# Altium schematic sheet OpAmps.SchDoc
size A3
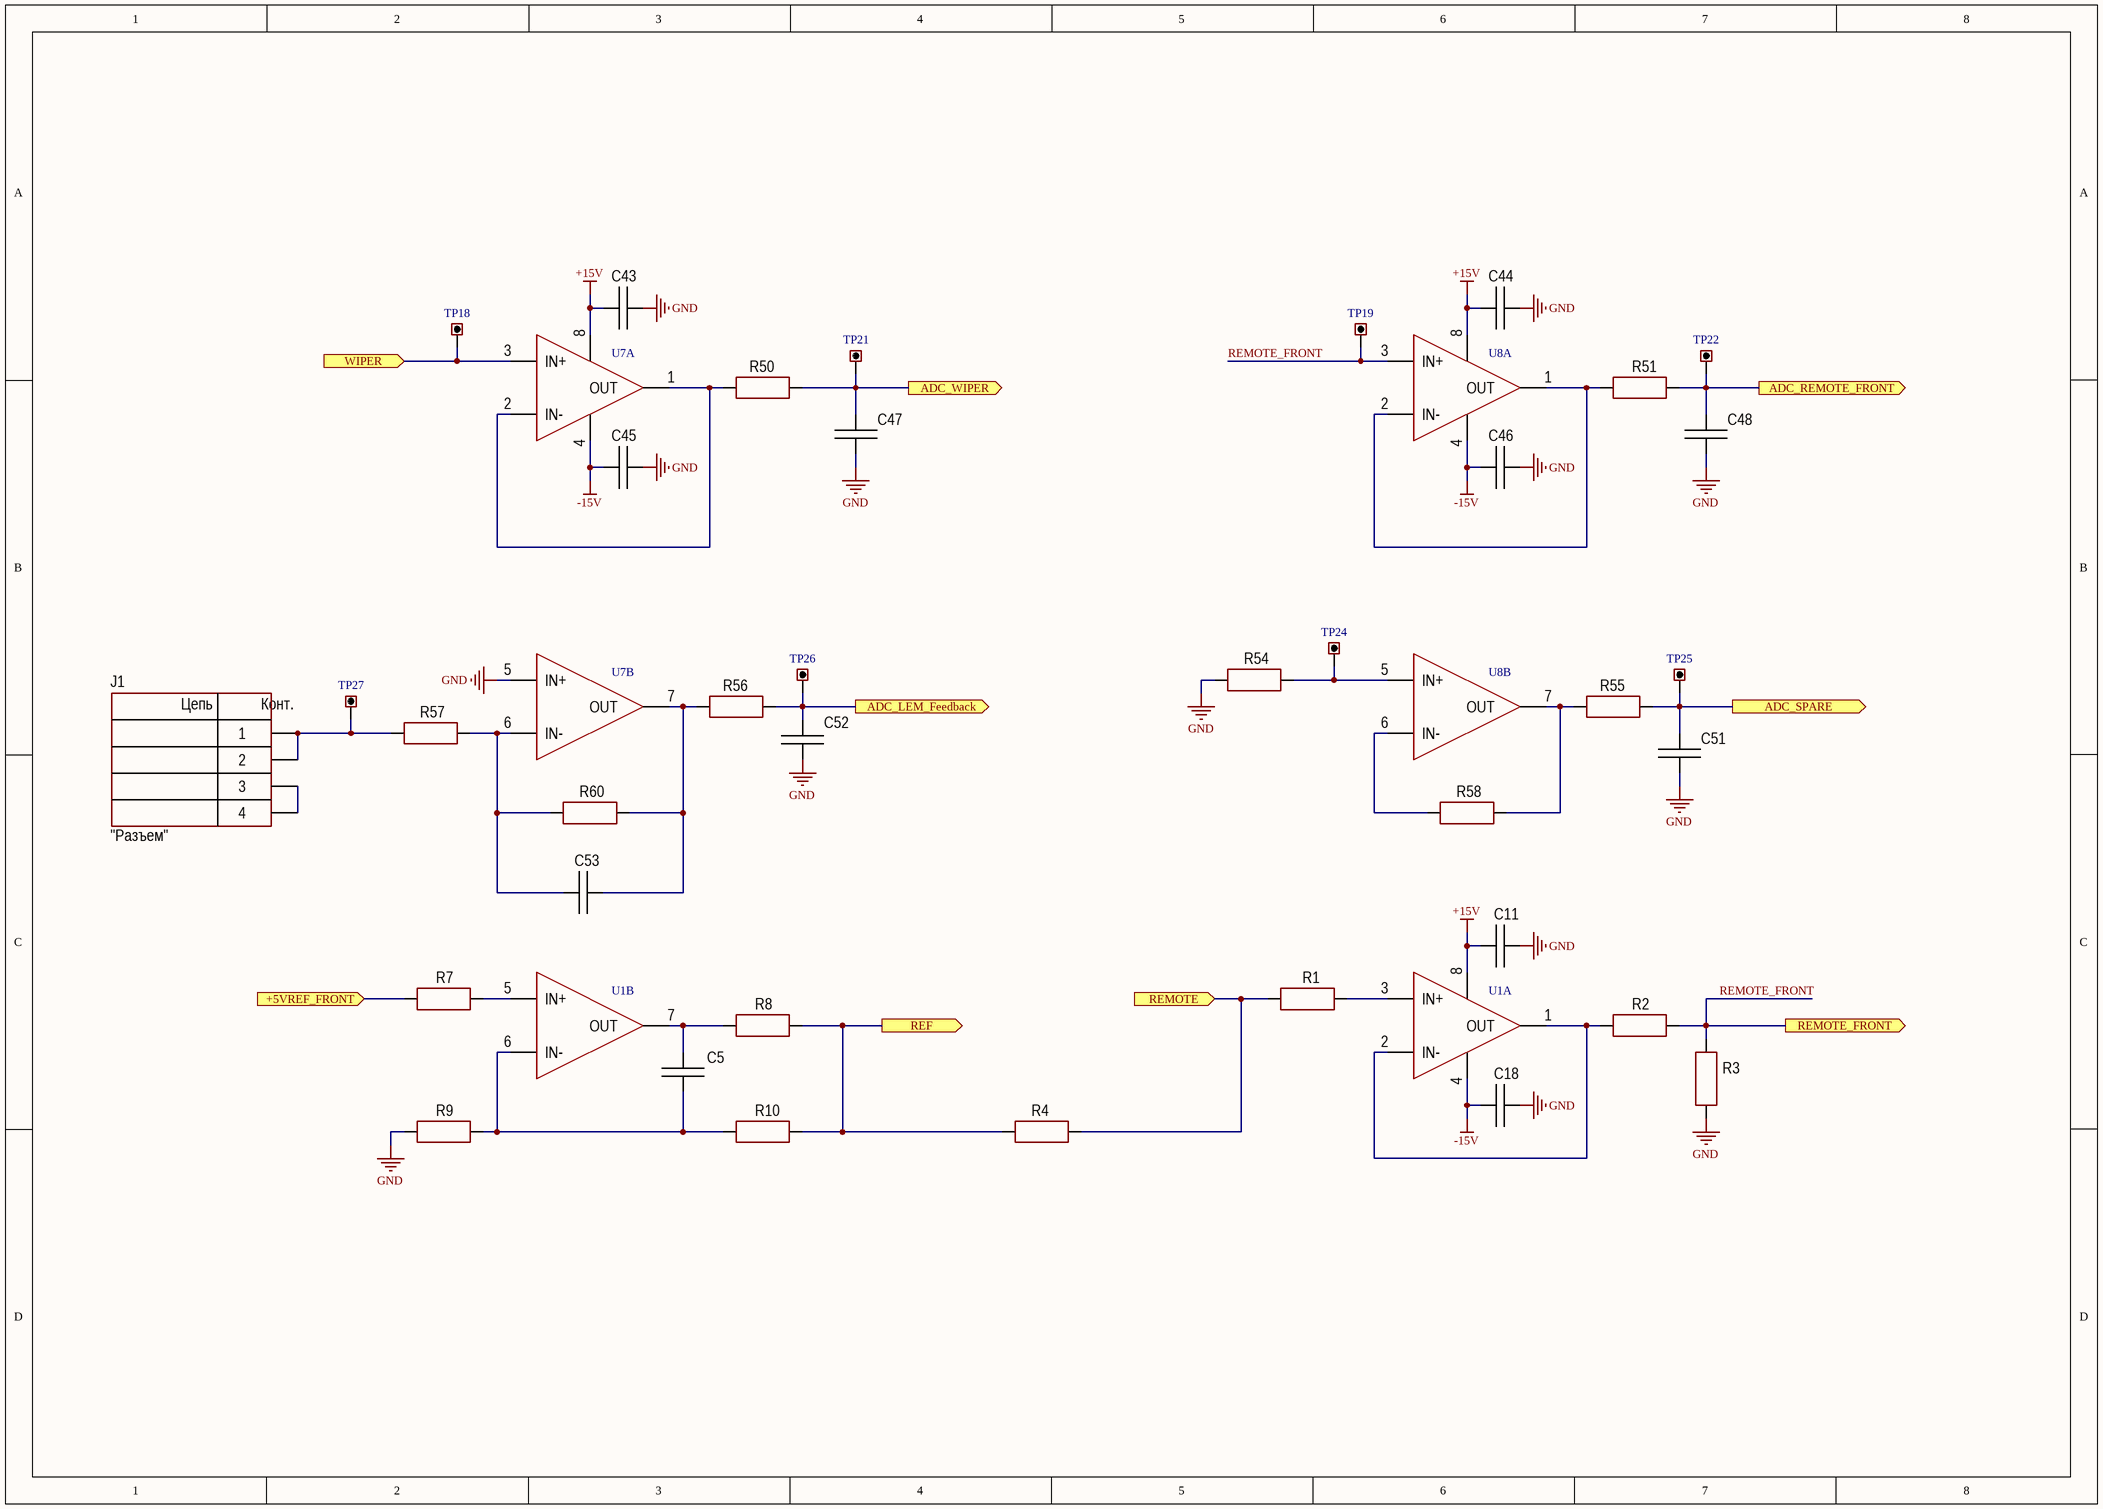
[diagram p0: OpAmps.SchDoc]

## Parts
C5  (no value)  [CAP: 1206]
C11  (no value)  [CAP: 1206]
C18  (no value)  [CAP: 1206]
C43  (no value)  [CAP: 1206]
C44  (no value)  [CAP: 1206]
C45  (no value)  [CAP: 1206]
C46  (no value)  [CAP: 1206]
C47  (no value)  [CAP: 1206]
C48  (no value)  [CAP: 1206]
C51  (no value)  [CAP: 1206]
C52  (no value)  [CAP: 1206]
C53  (no value)  [CAP: 1206]
J1  CommentText: "Разъем"  [39-29-9043]
R1  (no value)  [RES: 1206]
R2  (no value)  [RES: 1206]
R3  (no value)  [RES: 1206]
R4  (no value)  [RES: 1206]
R7  (no value)  [RES: 1206]
R8  (no value)  [RES: 1206]
R9  (no value)  [RES: 1206]
R10  (no value)  [RES: 1206]
R50  (no value)  [RES: 1206]
R51  (no value)  [RES: 1206]
R54  (no value)  [RES: 1206]
R55  (no value)  [RES: 1206]
R56  (no value)  [RES: 1206]
R57  (no value)  [RES: 1206]
R58  (no value)  [RES: 1206]
R60  (no value)  [RES: 1206]
TP18  Test_Point  [Test_Point]  (value not drawn)  (no BOM)
TP19  Test_Point  [Test_Point]  (value not drawn)  (no BOM)
TP21  Test_Point  [Test_Point]  (value not drawn)  (no BOM)
TP22  Test_Point  [Test_Point]  (value not drawn)  (no BOM)
TP24  Test_Point  [Test_Point]  (value not drawn)  (no BOM)
TP25  Test_Point  [Test_Point]  (value not drawn)  (no BOM)
TP26  Test_Point  [Test_Point]  (value not drawn)  (no BOM)
TP27  Test_Point  [Test_Point]  (value not drawn)  (no BOM)
U1  (no value)  [8-SOIC]  (parts A,B of 2)
U7  (no value)  [8-SOIC]  (parts A,B of 2)
U8  (no value)  [8-SOIC]  (parts A,B of 2)

## Ports
+5VREF_FRONT (in), ADC_LEM_Feedback (out), ADC_REMOTE_FRONT (out), ADC_SPARE (out), ADC_WIPER (out), REF (out), REMOTE (in), REMOTE_FRONT (out), WIPER (in)

## Nets
+15V: C11.2 C43.2 C44.2 U1.8(V+) U7.8(V+) U8.8(V+)
-15V: C18.1 C45.2 C46.2 U1.4(V-) U7.4(V-) U8.4(V-)
GND: C11.1 C18.2 C43.1 C44.1 C45.1 C46.1 C47.1 C48.1 C51.1 C52.1 R3.1 R9.1 R54.1 U7.5(IN+)
+5VREF_FRONT: R7.1 ; port +5VREF_FRONT
ADC_LEM_Feedback: C52.2 R56.2 TP26.1 ; port ADC_LEM_Feedback
ADC_REMOTE_FRONT: C48.2 R51.2 TP22.1 ; port ADC_REMOTE_FRONT
ADC_SPARE: C51.2 R55.2 TP25.1 ; port ADC_SPARE
ADC_WIPER: C47.2 R50.2 TP21.1 ; port ADC_WIPER
REF: R4.1 R8.2 R10.2 ; port REF
REMOTE: R1.1 R4.2 ; port REMOTE
REMOTE_FRONT: R2.2 R3.2 TP19.1 U8.3(IN+) ; port REMOTE_FRONT
WIPER: TP18.1 U7.3(IN+) ; port WIPER
NetC5_1: C5.1 R9.2 R10.1 U1.6(IN-)
NetC5_2: C5.2 R8.1 U1.7(OUT)
NetC53_1: C53.1 R56.1 R60.2 U7.7(OUT)
NetC53_2: C53.2 R57.2 R60.1 U7.6(IN-)
NetJ1_1: J1.1 J1.2 R57.1 TP27.1
NetJ1_3: J1.3 J1.4
NetR1_2: R1.2 U1.3(IN+)
NetR2_1: R2.1 U1.1(OUT) U1.2(IN-)
NetR7_2: R7.2 U1.5(IN+)
NetR50_1: R50.1 U7.1(OUT) U7.2(IN-)
NetR51_1: R51.1 U8.1(OUT) U8.2(IN-)
NetR54_2: R54.2 TP24.1 U8.5(IN+)
NetR55_1: R55.1 R58.2 U8.7(OUT)
NetR58_1: R58.1 U8.6(IN-)

## Notes on the sheet
- (in symbol PBD-4) Цепь; Конт.

## Library data of the parts
C5 C11 C18 C43-C46 C53 = Ceramic_1206: Manufacturer: Yageo; PartNumber: CC1206KRX7R9BB104; ValueManufacturerPartNumber: Ceramic capacitor, 0.1μF, 1206; TypeCapacitor: Ceramic capacitor; Tolerance: ±10%; TypeDielectric: X7R; Voltage: 50V; Value: 0.1μF; Package: 1206; HelpURL: https://www.digikey.com/product-detail/en/yageo/CC1206KRX7R9BB104/311-1179-1-ND/303089; Temperature: -55...+125°C
C47 C48 C51 C52 = Ceramic_1206: Manufacturer: Yageo; PartNumber: CC1206KRX7R9BB104; ValueManufacturerPartNumber: Ceramic capacitor, 33pF, 1206; TypeCapacitor: Ceramic capacitor; Tolerance: ±10%; TypeDielectric: X7R; Voltage: 50V; Value: 33pF; Package: 1206; HelpURL: https://www.digikey.com/product-detail/en/yageo/CC1206KRX7R9BB104/311-1179-1-ND/303089; Temperature: -55...+125°C
J1 = PBD-4: Manufacturer: MOLEX; ValueManufacturerPartNumber: Connector, MOLEX, 39-29-9043, 4pin; TypeConnector: Connector; VoltageMax: 500VAC; Pitch: 2.54mm; CurrentMax: 3A; Multichannel: 4pin; HelpURL: https://www.chipdip.ru/product/pbd-4; PartNumber: 39-29-9043
R1 R7 R9 R10 R54 R58 R60 = Resistor_1206: Manufacturer: Yageo; PartNumber: RC1206JR-07100RL; ValueManufacturerPartNumber: Resistor, 10K, 1206; Power: 0.25W; Tolerance: ±5%; Value: 10K; Package: 1206; HelpURL: https://www.digikey.com/product-detail/en/yageo/RC1206JR-07100RL/311-100ERCT-ND/732153; Temperature: -55...+125°C; TypeResistor: Resistor
R2 R3 = Resistor_1206: Manufacturer: Yageo; PartNumber: RC1206JR-07100RL; ValueManufacturerPartNumber: Resistor, 2K, 1206; Power: 0.25W; Tolerance: ±5%; Value: 2K; Package: 1206; HelpURL: https://www.digikey.com/product-detail/en/yageo/RC1206JR-07100RL/311-100ERCT-ND/732153; Temperature: -55...+125°C; TypeResistor: Resistor
R4 = Resistor_1206: Manufacturer: Yageo; PartNumber: RC1206JR-07100RL; ValueManufacturerPartNumber: Resistor, 100K, 1206; Power: 0.25W; Tolerance: ±5%; Value: 100K; Package: 1206; HelpURL: https://www.digikey.com/product-detail/en/yageo/RC1206JR-07100RL/311-100ERCT-ND/732153; Temperature: -55...+125°C; TypeResistor: Resistor
R8 = Resistor_1206: Manufacturer: Yageo; PartNumber: RC1206JR-07100RL; ValueManufacturerPartNumber: Resistor, 10R, 1206; Power: 0.25W; Tolerance: ±5%; Value: 10R; Package: 1206; HelpURL: https://www.digikey.com/product-detail/en/yageo/RC1206JR-07100RL/311-100ERCT-ND/732153; Temperature: -55...+125°C; TypeResistor: Resistor
R50 R51 R55 R56 = Resistor_1206: Manufacturer: Yageo; PartNumber: RC1206JR-07100RL; ValueManufacturerPartNumber: Resistor, 1K, 1206; Power: 0.25W; Tolerance: ±5%; Value: 1K; Package: 1206; HelpURL: https://www.digikey.com/product-detail/en/yageo/RC1206JR-07100RL/311-100ERCT-ND/732153; Temperature: -55...+125°C; TypeResistor: Resistor
R57 = Resistor_1206: Manufacturer: Yageo; PartNumber: RC1206JR-07100RL; ValueManufacturerPartNumber: Resistor, 20K, 1206; Power: 0.25W; Tolerance: ±5%; Value: 20K; Package: 1206; HelpURL: https://www.digikey.com/product-detail/en/yageo/RC1206JR-07100RL/311-100ERCT-ND/732153; Temperature: -55...+125°C; TypeResistor: Resistor
U1 U7 U8 = TL082: ValueManufacturerPartNumber: TL082, SOIC-8; Package: SOIC-8; PartNumber: TL082